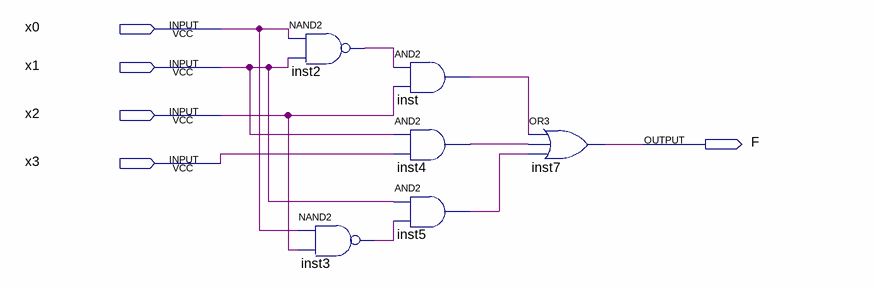
[diagram p0: schematic sheet]
// Quartus schematic Lab2.bdf as structural Verilog: 6 symbols, 5 pins
module Lab2 (
  input  x0,
  input  x1,
  input  x2,
  input  x3,
  output F
);

  wire inst2_out, inst3_out, inst4_out, inst5_out, inst_out;

  nand inst2 (inst2_out, x0, x1);
  nand inst3 (inst3_out, x0, x2);
  and inst (inst_out, inst2_out, x2);
  and inst4 (inst4_out, x1, x3);
  and inst5 (inst5_out, x1, inst3_out);
  or inst7 (F, inst_out, inst4_out, inst5_out);
endmodule
